# Altium schematic sheet Misc - Holes, Fiducials.SchDoc: [15] Misc - Holes, Fiducials
size A4; ApprovedBy: Nagy Richard; CheckedBy: Nagy Richard; Author: Nagy Richard; CompanyName: EmbedCore; DrawnBy: Nagy Richard; Engineer: Nagy Richard; Organization: EmbedCore; SheetNumber: 15; SheetTotal: 15
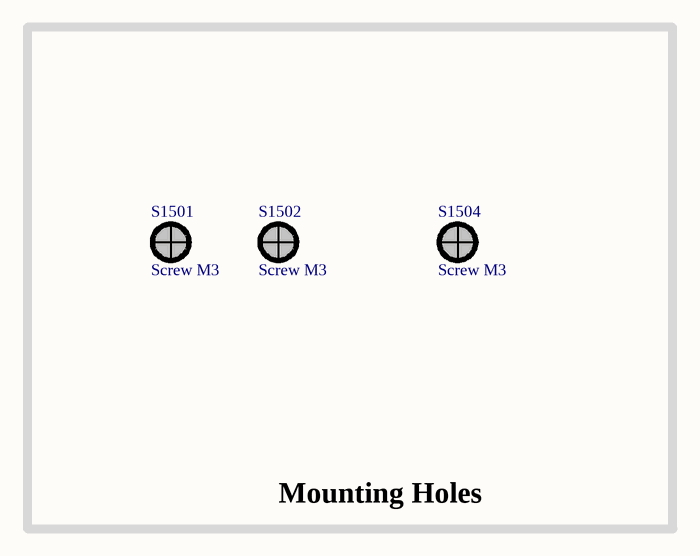
[diagram p0: Misc - Holes, Fiducials.SchDoc]

## Parts
S1501  Screw M3  [Screw M3]
S1502  Screw M3  [Screw M3]
S1504  Screw M3  [Screw M3]

## Blocks framed on the sheet
Mounting Holes: S1501 S1502 S1504

## Notes on the sheet
- Title:
- Drawn By:
- Page Contents:
- Checked By:
- Size:
- Date:
- File:
- License:
- Email:
- A4
- Number:
- Time:
- Revision:
- Sheet
- Website:
- of